# EAGLE design Stereo VU Meter v2 (EAGLE 7.2.0)
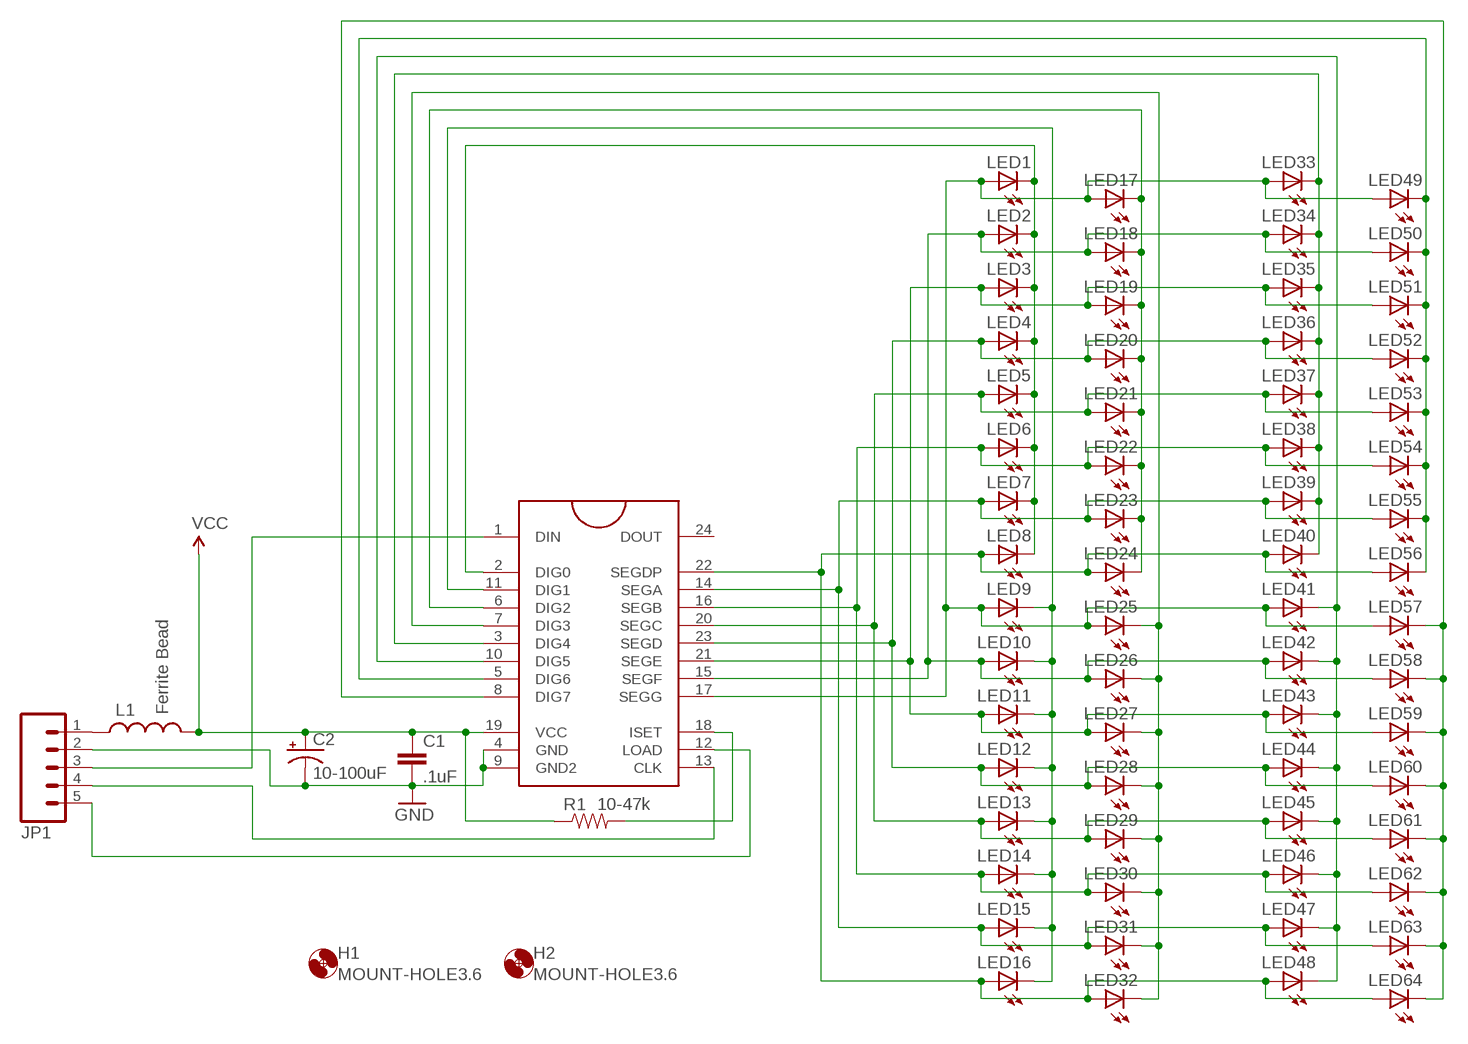
[diagram p0: schematic, sheet 1]

## Parts
C1  .1uF  CAPEZ  [CAP-PTH-SMALLEZ]
C2  10-100uF  CAP_POLPTH2  [CPOL-RADIAL-10UF-25V]
H1  MOUNT-HOLE3.6  [3,6]
H2  MOUNT-HOLE3.6  [3,6]
JP1  M05PTH  [1X05]
L1  Ferrite Bead  FERRITE_BEAD  [AXIAL-0.3]
LED1  LED3MM  [LED3MM]
LED2  LED3MM  [LED3MM]
LED3  LED3MM  [LED3MM]
LED4  LED3MM  [LED3MM]
LED5  LED3MM  [LED3MM]
LED6  LED3MM  [LED3MM]
LED7  LED3MM  [LED3MM]
LED8  LED3MM  [LED3MM]
LED9  LED3MM  [LED3MM]
LED10  LED3MM  [LED3MM]
LED11  LED3MM  [LED3MM]
LED12  LED3MM  [LED3MM]
LED13  LED3MM  [LED3MM]
LED14  LED3MM  [LED3MM]
LED15  LED3MM  [LED3MM]
LED16  LED3MM  [LED3MM]
LED17  LED3MM  [LED3MM]
LED18  LED3MM  [LED3MM]
LED19  LED3MM  [LED3MM]
LED20  LED3MM  [LED3MM]
LED21  LED3MM  [LED3MM]
LED22  LED3MM  [LED3MM]
LED23  LED3MM  [LED3MM]
LED24  LED3MM  [LED3MM]
LED25  LED3MM  [LED3MM]
LED26  LED3MM  [LED3MM]
LED27  LED3MM  [LED3MM]
LED28  LED3MM  [LED3MM]
LED29  LED3MM  [LED3MM]
LED30  LED3MM  [LED3MM]
LED31  LED3MM  [LED3MM]
LED32  LED3MM  [LED3MM]
LED33  LED3MM  [LED3MM]
LED34  LED3MM  [LED3MM]
LED35  LED3MM  [LED3MM]
LED36  LED3MM  [LED3MM]
LED37  LED3MM  [LED3MM]
LED38  LED3MM  [LED3MM]
LED39  LED3MM  [LED3MM]
LED40  LED3MM  [LED3MM]
LED41  LED3MM  [LED3MM]
LED42  LED3MM  [LED3MM]
LED43  LED3MM  [LED3MM]
LED44  LED3MM  [LED3MM]
LED45  LED3MM  [LED3MM]
LED46  LED3MM  [LED3MM]
LED47  LED3MM  [LED3MM]
LED48  LED3MM  [LED3MM]
LED49  LED3MM  [LED3MM]
LED50  LED3MM  [LED3MM]
LED51  LED3MM  [LED3MM]
LED52  LED3MM  [LED3MM]
LED53  LED3MM  [LED3MM]
LED54  LED3MM  [LED3MM]
LED55  LED3MM  [LED3MM]
LED56  LED3MM  [LED3MM]
LED57  LED3MM  [LED3MM]
LED58  LED3MM  [LED3MM]
LED59  LED3MM  [LED3MM]
LED60  LED3MM  [LED3MM]
LED61  LED3MM  [LED3MM]
LED62  LED3MM  [LED3MM]
LED63  LED3MM  [LED3MM]
LED64  LED3MM  [LED3MM]
R1  10-47k  RESISTORAXIAL-0.3  [AXIAL-0.3]
U1  MAX7221DIP  [DIL24]

## Nets
GND: C1.2 C2.2(-) JP1.2 U1.4(GND) U1.9(GND2)
N$1: LED1.K(C) LED2.K(C) LED3.K(C) LED4.K(C) LED5.K(C) LED6.K(C) LED7.K(C) LED8.K(C) U1.2(DIG0)
N$2: LED9.K(C) LED10.K(C) LED11.K(C) LED12.K(C) LED13.K(C) LED14.K(C) LED15.K(C) LED16.K(C) U1.11(DIG1)
N$3: LED17.K(C) LED18.K(C) LED19.K(C) LED20.K(C) LED21.K(C) LED22.K(C) LED23.K(C) LED24.K(C) U1.6(DIG2)
N$5: LED33.K(C) LED34.K(C) LED35.K(C) LED36.K(C) LED37.K(C) LED38.K(C) LED39.K(C) LED40.K(C) U1.3(DIG4)
N$6: LED41.K(C) LED42.K(C) LED43.K(C) LED44.K(C) LED45.K(C) LED46.K(C) LED47.K(C) LED48.K(C) U1.10(DIG5)
N$7: LED49.K(C) LED50.K(C) LED51.K(C) LED52.K(C) LED53.K(C) LED54.K(C) LED55.K(C) LED56.K(C) U1.5(DIG6)
N$8: LED57.K(C) LED58.K(C) LED59.K(C) LED60.K(C) LED61.K(C) LED62.K(C) LED63.K(C) LED64.K(C) U1.8(DIG7)
N$9: LED1.A LED9.A LED17.A LED25.A LED33.A LED41.A LED49.A LED57.A U1.17(SEGG)
N$10: LED4.A LED12.A LED20.A LED28.A LED36.A LED44.A LED52.A LED60.A U1.23(SEGD)
N$11: LED25.K(C) LED26.K(C) LED27.K(C) LED28.K(C) LED29.K(C) LED30.K(C) LED31.K(C) LED32.K(C) U1.7(DIG3)
N$12: JP1.1 L1.P$1
N$14: R1.P$2 U1.18(ISET)
N$15: JP1.3 U1.1(DIN)
N$16: JP1.4 U1.13(CLK)
N$17: LED2.A LED10.A LED18.A LED26.A LED34.A LED42.A LED50.A LED58.A U1.15(SEGF)
N$18: LED3.A LED11.A LED19.A LED27.A LED35.A LED43.A LED51.A LED59.A U1.21(SEGE)
N$19: JP1.5 U1.12(LOAD)
N$20: LED5.A LED13.A LED21.A LED29.A LED37.A LED45.A LED53.A LED61.A U1.20(SEGC)
N$21: LED6.A LED14.A LED22.A LED30.A LED38.A LED46.A LED54.A LED62.A U1.16(SEGB)
N$22: LED7.A LED15.A LED23.A LED31.A LED39.A LED47.A LED55.A LED63.A U1.14(SEGA)
N$23: LED8.A LED16.A LED24.A LED32.A LED40.A LED48.A LED56.A LED64.A U1.22(SEGDP)
VCC: C1.1 C2.1(+) L1.P$2 R1.P$1 U1.19(VCC)
Unconnected: U1.24(DOUT)

## Library data of the parts
C1 = SparkFun-Capacitors:CAP: Capacitor Standard 0603 ceramic capacitor, and 0.1" leaded capacitor.
C2 = SparkFun-Capacitors:CAP_POL: Capacitor Polarized These are standard SMD and PTH capacitors. Normally 10uF, 47uF, and 100uF in electrolytic and tantalum varieties. Always verify the external diameter of the through hole cap, it varies with capacity, voltage, and manufacturer. The EIA devices should be standard.
H1 H2 = holes:MOUNT-HOLE: MOUNTING HOLE with drill center marker
JP1 = SparkFun-Connectors:M05: Header 5 Standard 5-pin 0.1" header. Use with straight break away headers (SKU : PRT-00116), right angle break away headers (PRT-00553), swiss pins (PRT-00743), machine pins (PRT-00117), and female headers (PRT-00115). Molex polarized connector foot print use with SKU : PRT-08230 with associated crimp pins and housings.
L1 = Cort-Library:FERRITE_BEAD
LED1-LED64 = SparkFun-LED:LED: LEDs Standard schematic elements and footprints for 5mm, 3mm, 1206, and 0603 sized LEDs. 5mm - Spark Fun Electronics SKU : COM-00529 (and others)
R1 = SparkFun-Resistors:RESISTOR: Resistor Basic schematic elements and footprints for 0603, 1206, and PTH resistors.
U1 = Cort-Library:MAX7221: 8-digit, 8-segment LED display driver, serial input

## Board
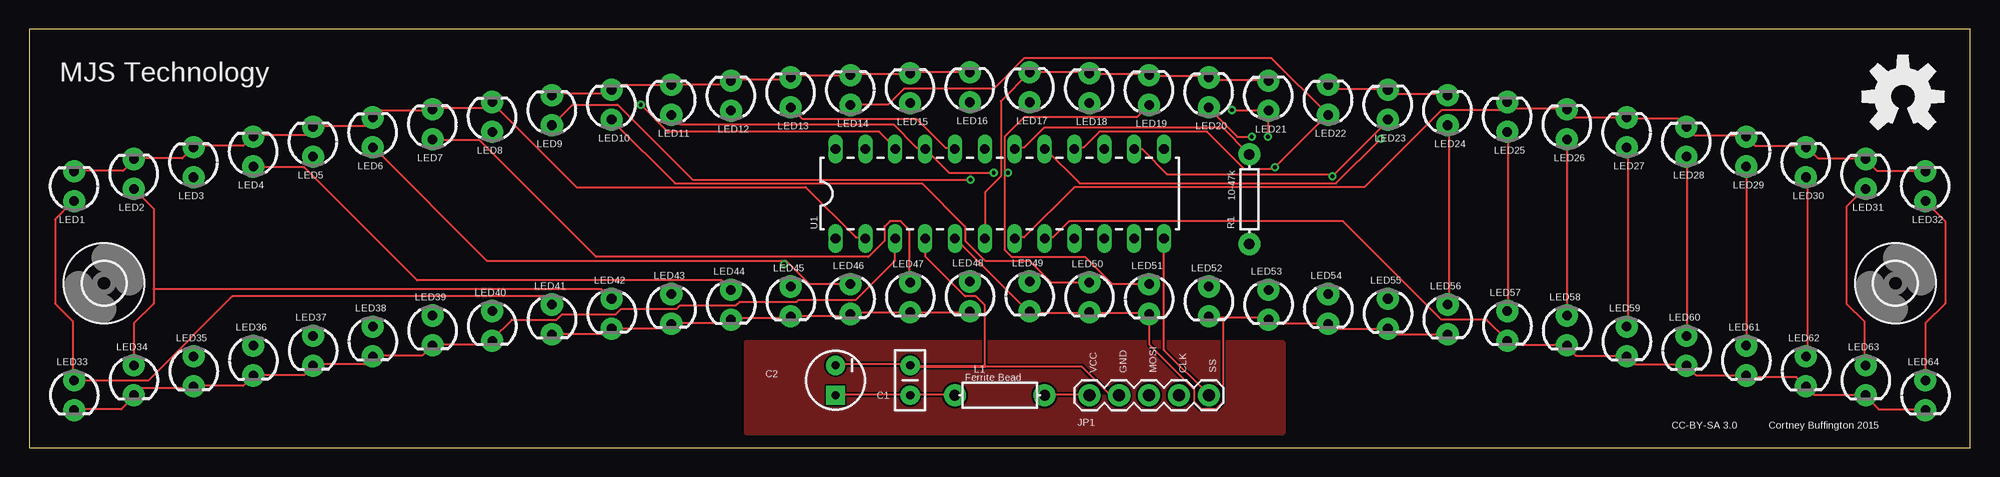
[diagram p1: board, top side]
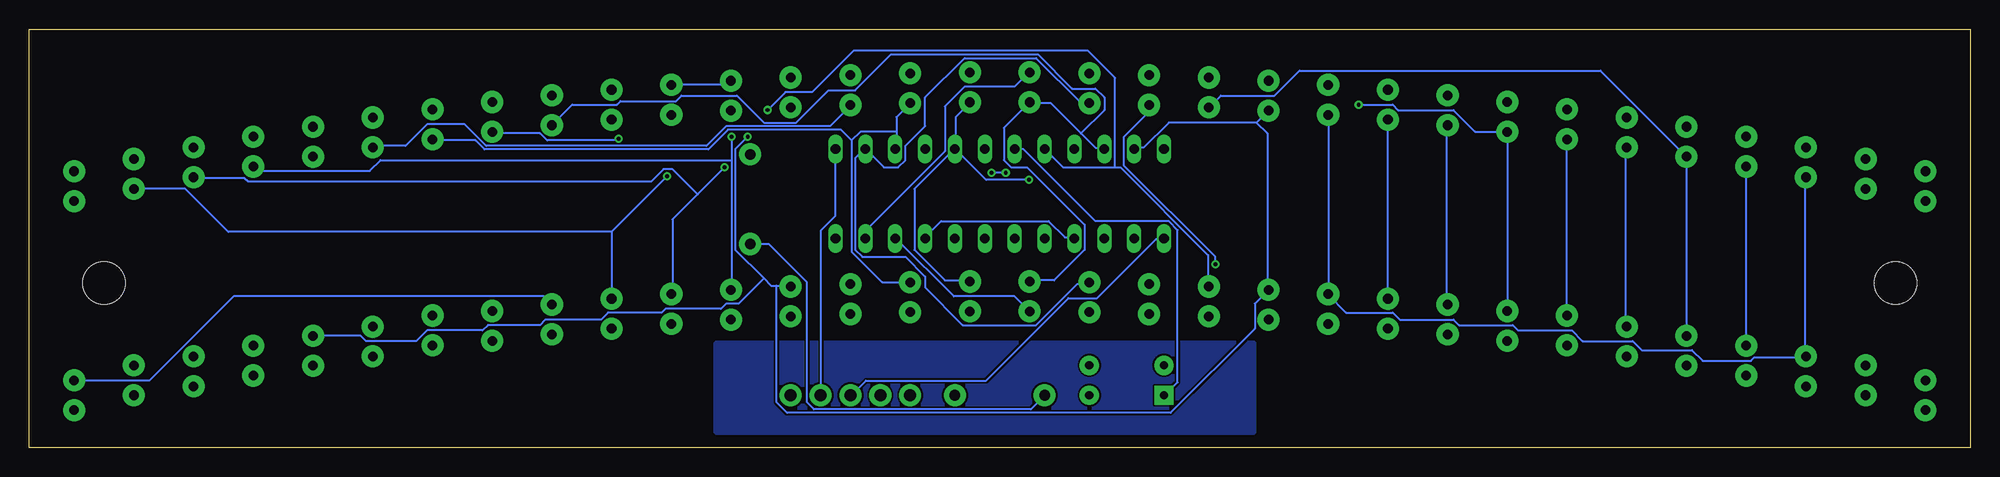
[diagram p2: board, bottom side, seen from below]

Size 165.1 x 35.56 mm. Coordinates in mm from the lower left corner, seen from the top.
Outline: 0,0 165.1,0 165.1,35.56 0,35.56 0,0
Copper layers (1*16): Top 0.0356mm / dielectric 1.5011mm / Bottom 0.0356mm
Design rules "LaenPCBOrder": minimum track width 6mil, minimum drill 13mil, track to track 6mil, track to pad 6mil, pad to pad 6mil, via to via 6mil, smd to smd 6mil, copper to edge 15mil, drill to drill 6mil, minimum pad ring 7mil, minimum via ring 7mil, stop-mask expansion 3mil, vias tented up to drill 0mil, thermal gap 10mil

### Footprints (pad centres in the part's own frame; a part is rotated, then mirrored left to right if it is on the bottom)
CAP-PTH-SMALLEZ = drill 0.7 pad 1.651: 1 0,0; 2 2.54,0
CPOL-RADIAL-10UF-25V = drill 0.7 pad 1.651 square: 1 1.27,0 | drill 0.7 pad 1.651: 2 -1.27,0
3,6 = hole 3.6: 0,0
1X05 = drill 1.016 pad 1.88: 1 0,0; 2 2.54,0; 3 5.08,0; 4 7.62,0; 5 10.16,0
AXIAL-0.3 = drill 0.9 pad 1.88: P$1 -3.81,0; P$2 3.81,0
LED3MM = drill 0.813 pad 1.88: A -1.27,0; K 1.27,0
DIL24 = drill 0.813 long: 1 -13.97,-3.81; 2 -11.43,-3.81; 3 -8.89,-3.81; 4 -6.35,-3.81; 5 -3.81,-3.81; 6 -1.27,-3.81; 7 1.27,-3.81; 8 3.81,-3.81; 9 6.35,-3.81; 10 8.89,-3.81; 11 11.43,-3.81; 12 13.97,-3.81; 13 13.97,3.81; 14 11.43,3.81; 15 8.89,3.81; 16 6.35,3.81; 17 3.81,3.81; 18 1.27,3.81; 19 -1.27,3.81; 20 -3.81,3.81; 21 -6.35,3.81; 22 -8.89,3.81; 23 -11.43,3.81; 24 -13.97,3.81

### Placement (x,y rotation side)
C1  74.93,4.45 90 top
C2  68.58,5.71 270 top
H1  6.35,13.97 0 top
H2  158.75,13.97 0 top
JP1  90.17,4.45 0 top
L1  82.55,4.45 180 top
LED1  3.81,22.22 90 top
LED2  8.89,23.27 90 top
LED3  13.97,24.26 90 top
LED4  19.05,25.17 90 top
LED5  24.13,26.01 90 top
LED6  29.21,26.8 90 top
LED7  34.29,27.48 90 top
LED8  39.37,28.12 90 top
LED9  44.45,28.68 90 top
LED10  49.53,29.16 90 top
LED11  54.61,29.57 90 top
LED12  59.69,29.92 90 top
LED13  64.77,30.2 90 top
LED14  69.85,30.4 90 top
LED15  74.93,30.56 90 top
LED16  80.01,30.63 90 top
LED17  85.09,30.63 90 top
LED18  90.17,30.56 90 top
LED19  95.25,30.4 90 top
LED20  100.33,30.2 90 top
LED21  105.41,29.92 90 top
LED22  110.49,29.57 90 top
LED23  115.57,29.16 90 top
LED24  120.65,28.68 90 top
LED25  125.73,28.12 90 top
LED26  130.81,27.48 90 top
LED27  135.89,26.8 90 top
LED28  140.97,26.01 90 top
LED29  146.05,25.17 90 top
LED30  151.13,24.26 90 top
LED31  156.21,23.27 90 top
LED32  161.29,22.22 90 top
LED33  3.81,4.45 270 top
LED34  8.89,5.71 270 top
LED35  13.97,6.48 270 top
LED36  19.05,7.39 270 top
LED37  24.13,8.23 270 top
LED38  29.21,9.02 270 top
LED39  34.29,9.96 270 top
LED40  39.37,10.34 270 top
LED41  44.45,10.9 270 top
LED42  49.53,11.38 270 top
LED43  54.61,11.79 270 top
LED44  59.69,12.14 270 top
LED45  64.77,12.42 270 top
LED46  69.85,12.62 270 top
LED47  74.93,12.78 270 top
LED48  80.01,12.85 270 top
LED49  85.09,12.85 270 top
LED50  90.17,12.78 270 top
LED51  95.25,12.62 270 top
LED52  100.33,12.42 270 top
LED53  105.41,12.14 270 top
LED54  110.49,11.79 270 top
LED55  115.57,11.38 270 top
LED56  120.65,10.9 270 top
LED57  125.73,10.34 270 top
LED58  130.81,9.96 270 top
LED59  135.89,9.02 270 top
LED60  140.97,8.23 270 top
LED61  146.05,7.39 270 top
LED62  151.13,6.48 270 top
LED63  156.21,5.71 270 top
LED64  161.29,4.45 270 top
R1  103.78,21.12 90 top
U1  82.55,21.59 0 top
U$1  [OSHW-LOGO-L]  159.39,29.84 0 top

### Tracks (layer width: path | path; a pad name or v marks a point on that pad's centre or on a via)
GND
  Top 0.152: C2.2 68.63,7.06 74.88,7.06 C1.2 75.03,6.91 | JP1.2 92.71,4.47 91.95,4.47 89.51,6.91 81.28,6.91 81.28,12.09 80.52,12.85 79.6,12.85 76.25,16.21 76.25,17.73 U1.4
  Top 0.254: 75.03,6.91 81.28,6.91
  Bottom 0.152: U1.4 76.25,17.88 77.01,17.88 78.38,19.25 87.53,19.25 88.9,17.88 U1.9
N$1
  Top 0.152: LED1.K 3.86,23.52 7.98,23.52 8.89,24.43 LED2.K 8.89,24.59 13,24.59 13.92,25.5 LED3.K 14.07,25.65 18.19,25.65 18.95,26.42 LED4.K 19.1,26.57 23.52,26.57 24.13,27.18 LED5.K 24.13,27.33 28.55,27.33 29.16,27.94 LED6.K 29.31,28.09 29.92,28.7 34.19,28.7 LED7.K 34.34,28.85 38.91,28.85 39.37,29.31 | 39.37,29.31 46.53,22.15 66.04,22.15 70.31,17.88 71.07,17.88 U1.2 | 39.37,29.31 LED8.K
N$2
  Top 0.152: LED9.K 44.55,30.07 49.12,30.07 49.43,30.38 LED10.K 49.58,30.53 49.89,30.84 LED11.K 59.33,30.84 LED12.K 59.79,31.29 64.52,31.29 64.67,31.45 LED13.K 64.82,31.6 69.85,31.6 LED14.K 69.85,31.75 74.88,31.75 LED15.K 75.03,31.9 LED16.K
  Bottom 0.152: U1.11 93.93,17.88 93.93,18.49 87.22,25.2 87.22,29.01 85.55,30.68 81.28,30.68 80.06,31.9 LED16.K
N$3
  Top 0.152: U1.6 81.28,21.69 82.65,23.06 82.65,29.46 LED17.K 90.12,31.9 LED18.K 90.27,31.75 95.15,31.75 LED19.K 95.3,31.6 100.33,31.6 LED20.K 100.33,31.45 100.48,31.29 105.36,31.29 LED21.K | LED24.K 120.6,30.07 115.88,30.07 115.57,30.38 LED23.K 115.57,30.53 110.85,30.53 110.54,30.84 LED22.K
  Bottom 0.152: LED22.K 105.82,30.84 105.51,31.14 LED21.K
N$4
  pour Top: 60.96,1.27 106.68,1.27 106.68,8.89 60.96,8.89
N$5
  Top 0.152: LED33.K 3.86,3.25 7.82,3.25 8.89,4.32 LED34.K 8.89,4.47 9.5,5.08 13.92,5.08 LED35.K 14.07,5.23 18.19,5.23 18.95,5.99 LED36.K 19.1,6.15 23.37,6.15 24.13,6.91 LED37.K 24.13,7.06 28.55,7.06 29.16,7.67 LED38.K 29.31,7.82 33.43,7.82 LED39.K 34.34,8.74 39.07,8.74 39.37,9.04 LED40.K 39.37,9.2 41.05,10.87 44.86,10.87 45.31,11.33 49.89,11.33 50.34,11.79 55.07,11.79 55.37,12.09 60.1,12.09 60.4,12.39 65.28,12.39 65.43,12.55 70.31,12.55 73.66,15.9 U1.3
N$6
  Top 0.152: LED41.K 44.55,9.65 48.97,9.65 49.43,10.11 LED42.K 54.3,10.11 54.61,10.41 LED43.K 54.61,10.57 59.33,10.57 59.64,10.87 LED44.K 59.79,10.87 59.94,11.02 64.67,11.02 LED45.K 64.82,11.18 69.7,11.18 69.85,11.33 LED46.K 69.85,11.48 74.88,11.48 LED47.K 75.03,11.48 79.91,11.48 LED48.K
  Bottom 0.152: LED48.K 81.28,12.85 86.46,12.85 91.34,17.73 U1.10
N$7
  Top 0.152: 85.09,11.48 78.84,17.73 U1.5 | 85.09,11.48 90.12,11.48 LED50.K 90.27,11.48 95.15,11.48 LED51.K 95.3,11.33 95.3,8.74 99.11,4.93 99.11,3.86 99.72,3.25 100.94,3.25 101.55,3.86 101.55,11.02 | 85.09,11.48 LED49.K | 101.55,11.02 105.21,11.02 105.36,10.87 LED53.K 105.51,10.87 105.82,10.57 110.39,10.57 LED54.K 110.54,10.41 110.85,10.11 LED55.K 116.03,9.65 120.6,9.65 LED56.K | 101.55,11.02 100.33,11.02 LED52.K
N$8
  Top 0.152: LED64.K 161.29,3.25 157.33,3.25 156.26,4.32 LED63.K 156.11,4.47 151.84,4.47 151.23,5.08 LED62.K 151.08,5.23 150.32,5.99 146.05,5.99 LED61.K 146.05,6.15 141.78,6.15 LED60.K 140.87,7.06 136.6,7.06 135.99,7.67 LED59.K 135.84,7.82 131.57,7.82 130.81,8.59 LED58.K 130.81,8.74 126.09,8.74 125.78,9.04 LED57.K 125.63,9.2 123.95,10.87 120.14,10.87 111.76,19.25 88.44,19.25 87.07,17.88 86.46,17.88 U1.8
N$9  (via drill 0.33)
  Top 0.152: LED57.A 125.78,11.63 125.78,26.72 LED25.A | v114.96,26.26 111.15,22.45 89.36,22.45 86.46,25.35 U1.17 | LED1.A 3.71,20.93 2.18,19.41 2.18,12.24 3.71,10.72 3.71,5.84 LED33.A 3.86,5.69 10.11,5.69 17.27,12.85 43.79,12.85 44.4,12.24 LED41.A | v80.06,22.76 56.44,22.76 50.04,29.16 46.23,29.16 44.55,27.48 LED9.A
  Bottom 0.152: U1.17 86.31,25.5 86.31,28.09 85.09,29.31 LED17.A | LED49.A 85.09,14.22 87.22,14.22 89.81,16.82 89.81,22 86.46,25.35 U1.17 | v114.96,26.26 115.11,26.11 121.06,26.11 121.67,26.72 125.63,26.72 LED25.A | LED41.A 44.55,12.24 44.55,27.33 LED9.A | U1.17 83.72,22.76 v80.06,22.76
N$10  (via drill 0.33)
  Top 0.152: LED60.A 141.02,9.5 141.02,24.74 LED28.A | v103.99,26.42 102.77,26.42 100.33,28.85 LED20.A | LED44.A 58.88,14.22 32.97,14.22 23.37,23.82 19.1,23.82 LED4.A
  Bottom 0.152: 101.55,13.77 102.01,13.77 102.62,14.38 | 101.55,13.77 100.33,13.77 LED52.A | 102.62,14.38 105.05,16.82 105.05,25.35 v103.99,26.42 | LED60.A 136.91,9.5 136.45,9.04 132.18,9.04 131.27,9.96 126.54,9.96 126.09,10.41 121.67,10.41 121.21,10.87 116.48,10.87 115.88,11.48 111.3,11.48 111,11.79 106.27,11.79 105.82,12.24 104.75,12.24 102.62,14.38 | LED36.A 19.1,8.74 19.1,23.82 LED4.A | 60.71,27.63 68.17,27.63 70.31,25.5 71.07,25.5 U1.23 | LED12.A 60.71,27.63 | 60.71,27.63 59.79,26.72 59.79,13.46 LED44.A 60.86,12.24 60.86,10.11 68.02,2.95 100.63,2.95 101.55,3.86 101.55,13.77
N$11
  Top 0.152: LED32.K 161.29,23.52 157.18,23.52 156.26,24.43 LED31.K 156.11,24.59 152.15,24.59 151.23,25.5 LED30.K 151.08,25.65 146.81,25.65 146.05,26.42 LED29.K 146.05,26.57 141.63,26.57 141.02,27.18 LED28.K 140.87,27.33 140.26,27.94 135.99,27.94 LED27.K 135.84,28.09 131.42,28.09 130.81,28.7 LED26.K 130.81,28.85 126.24,28.85 125.78,29.31 LED25.K 125.63,29.31 125.02,28.7 120.14,28.7 113.59,22.15 88.9,22.15 84.63,17.88 83.87,17.88 U1.7
N$12
  Top 0.152: L1.P$1 86.46,4.47 90.12,4.47 JP1.1
N$13
  pour Bottom: 60.96,1.27 106.68,1.27 106.68,8.89 60.96,8.89
N$14
  Top 0.152: U1.18 83.87,25.5 84.63,25.5 86.31,27.18 101.55,27.18 103.68,25.04 R1.P$2
N$15
  Bottom 0.152: U1.1 68.63,17.73 69.24,17.73 74.27,12.7 76.71,12.7 83.72,5.69 93.93,5.69 95.15,4.47 JP1.3
N$16
  Bottom 0.152: U1.13 96.52,19.71 97.74,18.49 97.74,4.47 JP1.4
N$17
  Top 0.152: LED26.A LED58.A | LED34.A 8.89,10.57 10.57,12.24 10.57,13.46 | 10.57,13.46 10.57,20.32 LED2.A | 10.57,13.46 48.67,13.46 49.43,12.7 LED42.A | LED50.A 90.12,14.07 86.92,14.07 85.09,15.9 81.28,15.9 79.6,17.58 79.6,18.8 75.95,22.45 54.92,22.45 49.58,27.79 LED10.A
  Bottom 0.152: 91.34,26.87 91.34,28.09 90.27,29.16 LED18.A | 91.34,26.87 91.34,25.5 U1.15 | 95.15,26.11 95.15,16.66 92.56,14.07 90.27,14.07 LED50.A | 95.15,26.11 94.39,26.87 91.34,26.87 | 95.15,26.11 96.06,27.03 105.66,27.03 107.34,25.35 126.39,25.35 127.15,26.11 130.81,26.11 LED26.A | LED42.A 49.58,12.7 49.58,27.79 LED10.A
N$18  (via drill 0.33)
  Top 0.152: LED59.A 135.99,10.41 135.99,25.5 LED27.A | 82.96,23.37 82.96,26.42 84.63,28.09 94.23,28.09 95.15,29.01 LED19.A | 82.96,23.37 82.96,16.82 83.57,16.21 89.81,16.21 92.1,13.92 95.15,13.92 LED51.A | LED11.A 54.61,28.25 55.37,27.48 73.51,27.48 75.49,25.5 76.1,25.5 U1.21 78.23,23.37 v82.04,23.37 | v83.26,23.37 82.96,23.37
  Bottom 0.152: LED27.A 135.84,25.65 133.1,25.65 131.27,27.48 128.07,27.48 126.24,25.65 107.49,25.65 105.82,27.33 96.98,27.33 95.3,29.01 LED19.A | LED3.A 14.07,22.91 14.07,7.82 LED35.A 14.07,7.67 18.34,7.67 18.64,7.37 22.76,7.37 23.67,8.28 27.94,8.28 28.7,9.04 32.97,9.04 33.88,9.96 38.46,9.96 38.91,10.41 43.49,10.41 43.94,10.87 48.51,10.87 49.12,11.48 53.09,11.48 54.61,13 LED43.A LED11.A | v82.04,23.37 v83.26,23.37
N$19
  Top 0.152: U1.12 96.52,8.28 100.33,4.47 JP1.5
N$20  (via drill 0.33)
  Top 0.152: v105.36,26.42 105.36,28.55 LED21.A 105.36,28.7 v102.31,28.7 | LED29.A LED61.A | U1.20 78.69,25.5 77.93,25.5 75.49,27.94 65.73,27.94 64.82,28.85 LED13.A
  Bottom 0.152: v105.36,26.42 105.36,24.43 | 105.36,24.43 105.36,13.46 LED53.A | 105.36,24.43 135.23,24.43 136.14,23.52 145.75,23.52 146.05,23.82 LED29.A | LED37.A LED5.A 31.45,32.05 57.05,32.05 59.18,29.92 63.75,29.92 64.67,29.01 LED13.A | 72.75,23.82 77.16,23.82 U1.20 | 72.75,23.82 72.29,23.82 64.82,16.36 64.82,13.77 LED45.A | v102.31,28.7 100.79,30.23 98.5,30.23 95,33.73 75.03,33.73 72.75,31.45 72.75,23.82
N$21  (via drill 0.33)
  Top 0.152: 64.21,15.9 38.91,15.9 29.31,25.5 LED6.A | 64.21,15.9 64.36,15.9 66.34,13.92 69.85,13.92 LED46.A | 64.21,15.9 v64.21,15.6 | LED62.A 151.23,7.82 151.23,22.91 LED30.A | U1.16 88.9,25.5 89.66,25.5 91.03,26.87 100.18,26.87 103.38,23.67 105.82,23.67 v105.97,23.82 110.39,28.25 LED22.A 105.66,33.12 84.63,33.12 82.04,30.53 74.42,30.53 73.05,29.16 69.85,29.16 LED14.A
  Bottom 0.152: LED38.A 29.31,10.41 29.31,25.5 LED6.A | LED14.A 69.85,28.55 71.98,26.42 71.98,23.98 64.21,16.21 v64.21,15.6 | v105.97,23.82 108.25,21.54 | 108.25,21.54 110.39,19.41 110.39,13.16 LED54.A | 108.25,21.54 110.39,23.67 111.15,23.67 112.22,22.61 146.51,22.61 146.81,22.91 151.08,22.91 LED30.A
N$22  (via drill 0.33)
  Top 0.152: LED63.A 156.11,7.06 156.11,10.72 154.58,12.24 154.58,20.47 156.11,22 LED31.A | 110.85,23.22 111,23.22 115.57,27.79 LED23.A | 110.85,23.22 96.83,23.22 94.69,25.35 94.08,25.35 U1.14 | 110.85,23.22 v110.85,23.06 | LED7.A 34.34,26.11 38.3,26.11 48.21,16.21 71.37,16.21 72.75,17.58 72.75,18.8 73.2,19.25 74.12,19.25 74.88,18.49 74.88,14.07 LED47.A
  Bottom 0.152: LED39.A 34.34,11.33 34.34,26.11 LED7.A | LED47.A 75.03,13.92 75.95,13.92 79.45,10.41 85.7,10.41 88.9,13.61 88.9,14.53 90.58,16.21 94.23,16.21 94.84,16.82 94.84,24.59 94.08,25.35 U1.14 92.41,23.82 91.19,23.82 90.58,24.43 90.58,25.65 88.9,27.33 88.9,29.77 85.55,33.12 79.45,33.12 75.64,29.31 75.03,29.31 LED15.A | 115.57,18.34 LED55.A | v110.85,23.06 115.57,18.34 | LED31.A 151.84,22 148.18,18.34 115.57,18.34
N$23  (via drill 0.33)
  Top 0.152: v52.02,29.16 54.3,26.87 72.29,26.87 73.66,25.5 U1.22 | LED64.A 161.29,10.57 162.97,12.24 162.97,19.25 161.29,20.93 LED32.A | LED56.A 120.75,12.24 120.75,27.33 LED24.A
  Bottom 0.152: LED40.A LED8.A 39.37,26.87 42.11,26.87 43.94,28.7 48.67,28.7 49.12,29.16 v52.02,29.16 | 75.64,26.72 78.23,29.31 79.91,29.31 LED16.A 82.19,27.18 82.19,24.43 81.58,23.82 80.21,23.82 75.34,18.95 75.34,16.82 77.93,14.22 79.91,14.22 LED48.A | 75.64,26.72 74.42,25.5 73.66,25.5 U1.22 | LED64.A 161.29,5.69 154.89,5.69 147.73,12.85 121.36,12.85 120.75,12.24 LED56.A | 75.64,26.72 73.66,28.7 73.66,29.77 74.42,30.53 76.4,30.53 79.3,33.43 91.8,33.43 94.84,30.38 97.13,30.38 99.87,27.63 102.62,27.63 104.9,29.92 109.63,29.92 110.08,29.46 114.81,29.46 115.11,29.16 118.92,29.16 120.6,27.48 LED24.A
VCC
  Top 0.152: L1.P$2 78.69,4.47 75.03,4.47 C1.1 74.88,4.47 68.63,4.47 C2.1
  Bottom 0.152: U1.19 81.28,25.35 80.52,25.35 74.42,19.25 68.17,19.25 67.41,18.49 67.41,5.54 68.48,4.47 C2.1 | R1.P$1 103.68,17.27 102.16,17.27 98.96,14.07 98.96,3.86 98.35,3.25 79.91,3.25 78.84,4.32 L1.P$2

### Text on the board
tNames: MJS Technology | VCC | GND | MOSI | CLK | SS | CC-BY-SA 3.0 | Cortney Buffington 2015